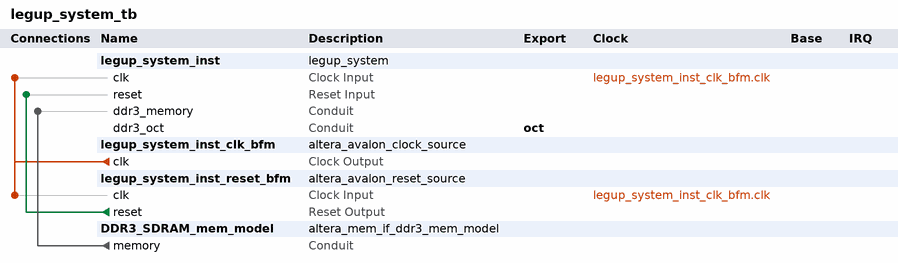
[diagram p0: system contents]
# Platform Designer (Qsys) system legup_system_tb, Stratix V 5SGXEA7N2F45C2
# Parameters at their usual value, and those the tool derives, are not listed.
package require -exact qsys 15.0
create_system legup_system_tb
set_project_property DEVICE_FAMILY {Stratix V}
set_project_property DEVICE 5SGXEA7N2F45C2

add_instance legup_system_inst legup_system 1.0

add_instance legup_system_inst_clk_bfm altera_avalon_clock_source 15.0

add_instance legup_system_inst_reset_bfm altera_avalon_reset_source 15.0
set_instance_parameter_value legup_system_inst_reset_bfm ASSERT_HIGH_RESET 0
set_instance_parameter_value legup_system_inst_reset_bfm INITIAL_RESET_CYCLES 50

add_instance DDR3_SDRAM_mem_model altera_mem_if_ddr3_mem_model 15.0
set_instance_parameter_value DDR3_SDRAM_mem_model ALTMEMPHY_COMPATIBLE_MODE false
set_instance_parameter_value DDR3_SDRAM_mem_model AP_MODE false
set_instance_parameter_value DDR3_SDRAM_mem_model AP_MODE_EN 0
set_instance_parameter_value DDR3_SDRAM_mem_model CFG_TCCD_NS 2.5
set_instance_parameter_value DDR3_SDRAM_mem_model CUT_NEW_FAMILY_TIMING true
set_instance_parameter_value DDR3_SDRAM_mem_model DAT_DATA_WIDTH 32
set_instance_parameter_value DDR3_SDRAM_mem_model DEVICE_DEPTH 1
set_instance_parameter_value DDR3_SDRAM_mem_model DISABLE_CHILD_MESSAGING false
set_instance_parameter_value DDR3_SDRAM_mem_model DISCRETE_FLY_BY true
set_instance_parameter_value DDR3_SDRAM_mem_model DUPLICATE_AC false
set_instance_parameter_value DDR3_SDRAM_mem_model FORCE_DQS_TRACKING AUTO
set_instance_parameter_value DDR3_SDRAM_mem_model FORCE_SHADOW_REGS AUTO
set_instance_parameter_value DDR3_SDRAM_mem_model HARD_EMIF false
set_instance_parameter_value DDR3_SDRAM_mem_model HHP_HPS false
set_instance_parameter_value DDR3_SDRAM_mem_model HHP_HPS_SIMULATION false
set_instance_parameter_value DDR3_SDRAM_mem_model HHP_HPS_VERIFICATION false
set_instance_parameter_value DDR3_SDRAM_mem_model HPS_PROTOCOL DEFAULT
set_instance_parameter_value DDR3_SDRAM_mem_model IS_ES_DEVICE false
set_instance_parameter_value DDR3_SDRAM_mem_model LRDIMM_EXTENDED_CONFIG 0x000000000000000000
set_instance_parameter_value DDR3_SDRAM_mem_model MEM_ASR Manual
set_instance_parameter_value DDR3_SDRAM_mem_model MEM_ATCL Disabled
set_instance_parameter_value DDR3_SDRAM_mem_model MEM_AUTO_LEVELING_MODE true
set_instance_parameter_value DDR3_SDRAM_mem_model MEM_BANKADDR_WIDTH 3
set_instance_parameter_value DDR3_SDRAM_mem_model MEM_BL OTF
set_instance_parameter_value DDR3_SDRAM_mem_model MEM_BT Sequential
set_instance_parameter_value DDR3_SDRAM_mem_model MEM_CK_WIDTH 1
set_instance_parameter_value DDR3_SDRAM_mem_model MEM_CLK_EN_WIDTH 1
set_instance_parameter_value DDR3_SDRAM_mem_model MEM_CLK_FREQ 800.0
set_instance_parameter_value DDR3_SDRAM_mem_model MEM_CLK_FREQ_MAX 800.0
set_instance_parameter_value DDR3_SDRAM_mem_model MEM_COL_ADDR_WIDTH 10
set_instance_parameter_value DDR3_SDRAM_mem_model MEM_CS_WIDTH 1
set_instance_parameter_value DDR3_SDRAM_mem_model MEM_DLL_EN true
set_instance_parameter_value DDR3_SDRAM_mem_model MEM_DQ_PER_DQS 8
set_instance_parameter_value DDR3_SDRAM_mem_model MEM_DQ_WIDTH 64
set_instance_parameter_value DDR3_SDRAM_mem_model MEM_DRV_STR RZQ/7
set_instance_parameter_value DDR3_SDRAM_mem_model MEM_FORMAT UNBUFFERED
set_instance_parameter_value DDR3_SDRAM_mem_model MEM_GUARANTEED_WRITE_INIT false
set_instance_parameter_value DDR3_SDRAM_mem_model MEM_IF_BOARD_BASE_DELAY 10
set_instance_parameter_value DDR3_SDRAM_mem_model MEM_IF_DM_PINS_EN true
set_instance_parameter_value DDR3_SDRAM_mem_model MEM_IF_DQSN_EN true
set_instance_parameter_value DDR3_SDRAM_mem_model MEM_IF_SIM_VALID_WINDOW 0
set_instance_parameter_value DDR3_SDRAM_mem_model MEM_INIT_EN false
set_instance_parameter_value DDR3_SDRAM_mem_model MEM_MIRROR_ADDRESSING 0
set_instance_parameter_value DDR3_SDRAM_mem_model MEM_NUMBER_OF_DIMMS 1
set_instance_parameter_value DDR3_SDRAM_mem_model MEM_NUMBER_OF_RANKS_PER_DEVICE 1
set_instance_parameter_value DDR3_SDRAM_mem_model MEM_NUMBER_OF_RANKS_PER_DIMM 1
set_instance_parameter_value DDR3_SDRAM_mem_model MEM_PD {DLL off}
set_instance_parameter_value DDR3_SDRAM_mem_model MEM_RANK_MULTIPLICATION_FACTOR 1
set_instance_parameter_value DDR3_SDRAM_mem_model MEM_ROW_ADDR_WIDTH 14
set_instance_parameter_value DDR3_SDRAM_mem_model MEM_RTT_NOM RZQ/6
set_instance_parameter_value DDR3_SDRAM_mem_model MEM_RTT_WR RZQ/4
set_instance_parameter_value DDR3_SDRAM_mem_model MEM_SRT Normal
set_instance_parameter_value DDR3_SDRAM_mem_model MEM_TCL 11
set_instance_parameter_value DDR3_SDRAM_mem_model MEM_TFAW_NS 30.0
set_instance_parameter_value DDR3_SDRAM_mem_model MEM_TINIT_US 500
set_instance_parameter_value DDR3_SDRAM_mem_model MEM_TMRD_CK 4
set_instance_parameter_value DDR3_SDRAM_mem_model MEM_TRAS_NS 35.0
set_instance_parameter_value DDR3_SDRAM_mem_model MEM_TRCD_NS 13.75
set_instance_parameter_value DDR3_SDRAM_mem_model MEM_TREFI_US 7.8
set_instance_parameter_value DDR3_SDRAM_mem_model MEM_TRFC_NS 160.0
set_instance_parameter_value DDR3_SDRAM_mem_model MEM_TRP_NS 13.75
set_instance_parameter_value DDR3_SDRAM_mem_model MEM_TRRD_NS 6.0
set_instance_parameter_value DDR3_SDRAM_mem_model MEM_TRTP_NS 7.5
set_instance_parameter_value DDR3_SDRAM_mem_model MEM_TWR_NS 15.0
set_instance_parameter_value DDR3_SDRAM_mem_model MEM_TWTR 4
set_instance_parameter_value DDR3_SDRAM_mem_model MEM_USER_LEVELING_MODE Leveling
set_instance_parameter_value DDR3_SDRAM_mem_model MEM_VENDOR Micron
set_instance_parameter_value DDR3_SDRAM_mem_model MEM_VERBOSE true
set_instance_parameter_value DDR3_SDRAM_mem_model MEM_WTCL 8
set_instance_parameter_value DDR3_SDRAM_mem_model MRS_MIRROR_PING_PONG_ATSO false
set_instance_parameter_value DDR3_SDRAM_mem_model NEXTGEN true
set_instance_parameter_value DDR3_SDRAM_mem_model PARSE_FRIENDLY_DEVICE_FAMILY_PARAM_VALID false
set_instance_parameter_value DDR3_SDRAM_mem_model PINGPONGPHY_EN false
set_instance_parameter_value DDR3_SDRAM_mem_model RATE Quarter
set_instance_parameter_value DDR3_SDRAM_mem_model RDIMM_CONFIG 0000000000000000
set_instance_parameter_value DDR3_SDRAM_mem_model REFRESH_BURST_VALIDATION false
set_instance_parameter_value DDR3_SDRAM_mem_model SPEED_GRADE 2
set_instance_parameter_value DDR3_SDRAM_mem_model TIMING_TDH 45
set_instance_parameter_value DDR3_SDRAM_mem_model TIMING_TDQSCK 255
set_instance_parameter_value DDR3_SDRAM_mem_model TIMING_TDQSCKDL 1200
set_instance_parameter_value DDR3_SDRAM_mem_model TIMING_TDQSCKDM 900
set_instance_parameter_value DDR3_SDRAM_mem_model TIMING_TDQSCKDS 450
set_instance_parameter_value DDR3_SDRAM_mem_model TIMING_TDQSQ 100
set_instance_parameter_value DDR3_SDRAM_mem_model TIMING_TDQSS 0.27
set_instance_parameter_value DDR3_SDRAM_mem_model TIMING_TDS 10
set_instance_parameter_value DDR3_SDRAM_mem_model TIMING_TDSH 0.18
set_instance_parameter_value DDR3_SDRAM_mem_model TIMING_TDSS 0.18
set_instance_parameter_value DDR3_SDRAM_mem_model TIMING_TIH 120
set_instance_parameter_value DDR3_SDRAM_mem_model TIMING_TIS 170
set_instance_parameter_value DDR3_SDRAM_mem_model TIMING_TQH 0.38
set_instance_parameter_value DDR3_SDRAM_mem_model TIMING_TQSH 0.4
set_instance_parameter_value DDR3_SDRAM_mem_model USE_MEM_CLK_FREQ false

# connections
add_connection legup_system_inst_clk_bfm.clk legup_system_inst.clk clock
add_connection legup_system_inst_clk_bfm.clk legup_system_inst_reset_bfm.clk clock
add_connection legup_system_inst_reset_bfm.reset legup_system_inst.reset reset
add_connection DDR3_SDRAM_mem_model.memory legup_system_inst.ddr3_memory conduit

# exported interfaces
add_interface oct conduit end
set_interface_property oct EXPORT_OF legup_system_inst.ddr3_oct

set_interconnect_requirement {$system} qsys_mm.clockCrossingAdapter HANDSHAKE
set_interconnect_requirement {$system} qsys_mm.enableEccProtection FALSE
set_interconnect_requirement {$system} qsys_mm.insertDefaultSlave FALSE
set_interconnect_requirement {$system} qsys_mm.maxAdditionalLatency 1

save_system legup_system_tb.qsys
